# EAGLE design subliminal1 (EAGLE 9.0.1)
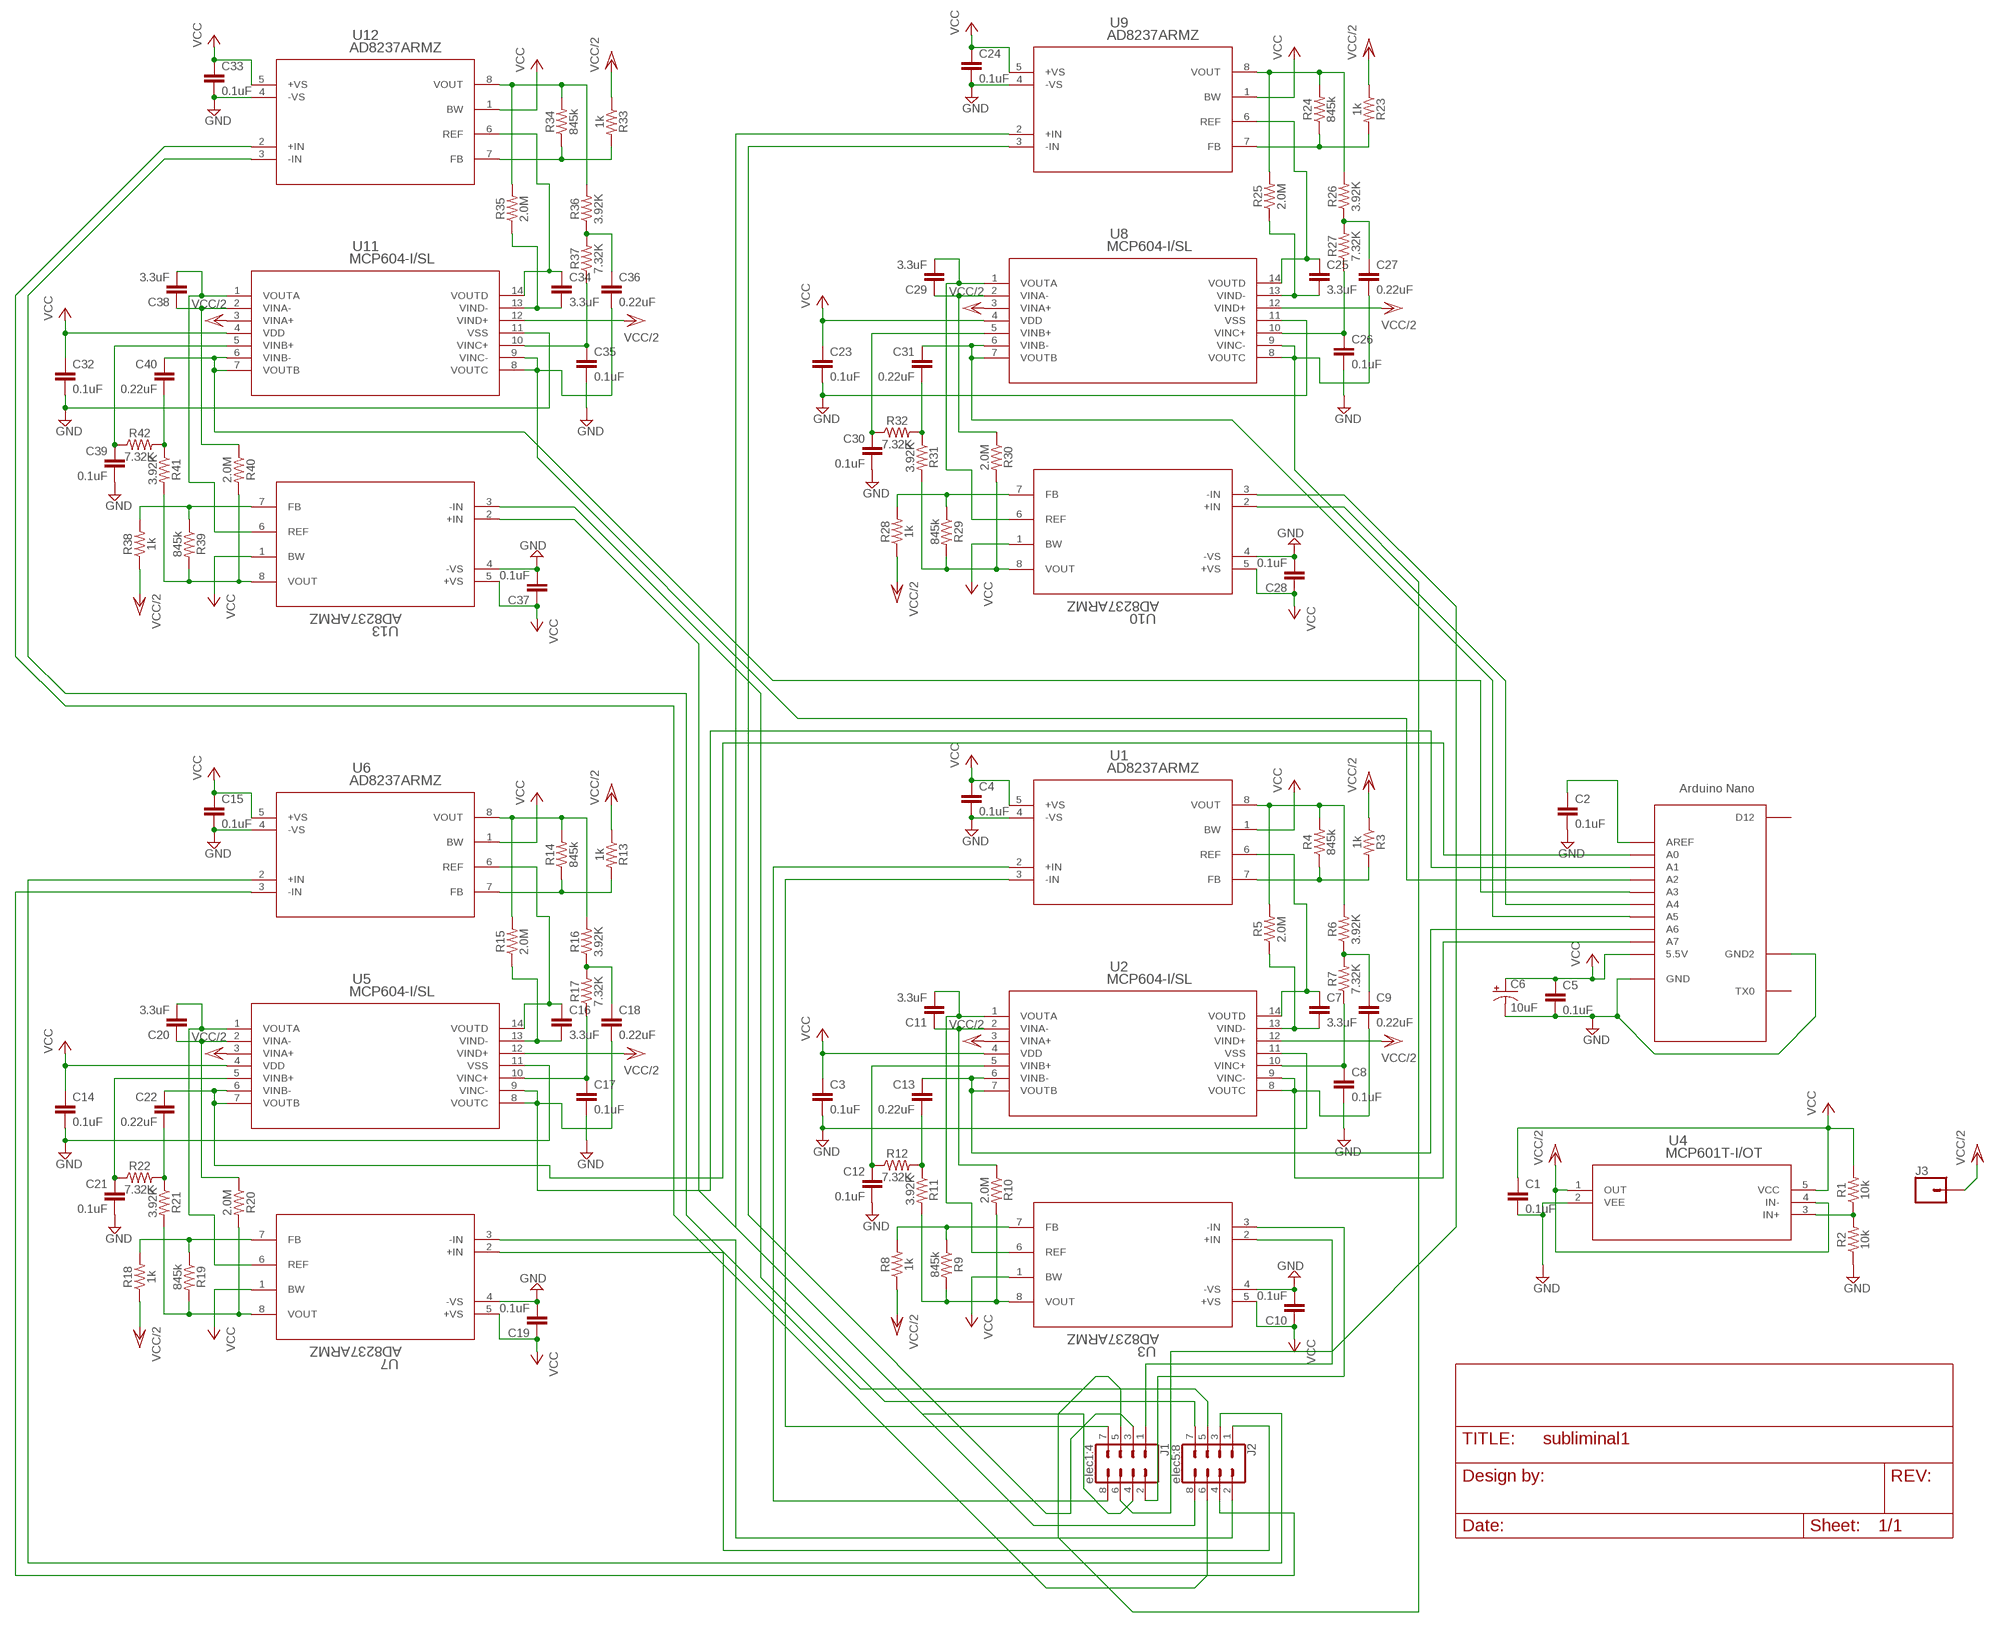
[diagram p0: schematic, sheet 1, part 1 of 2]
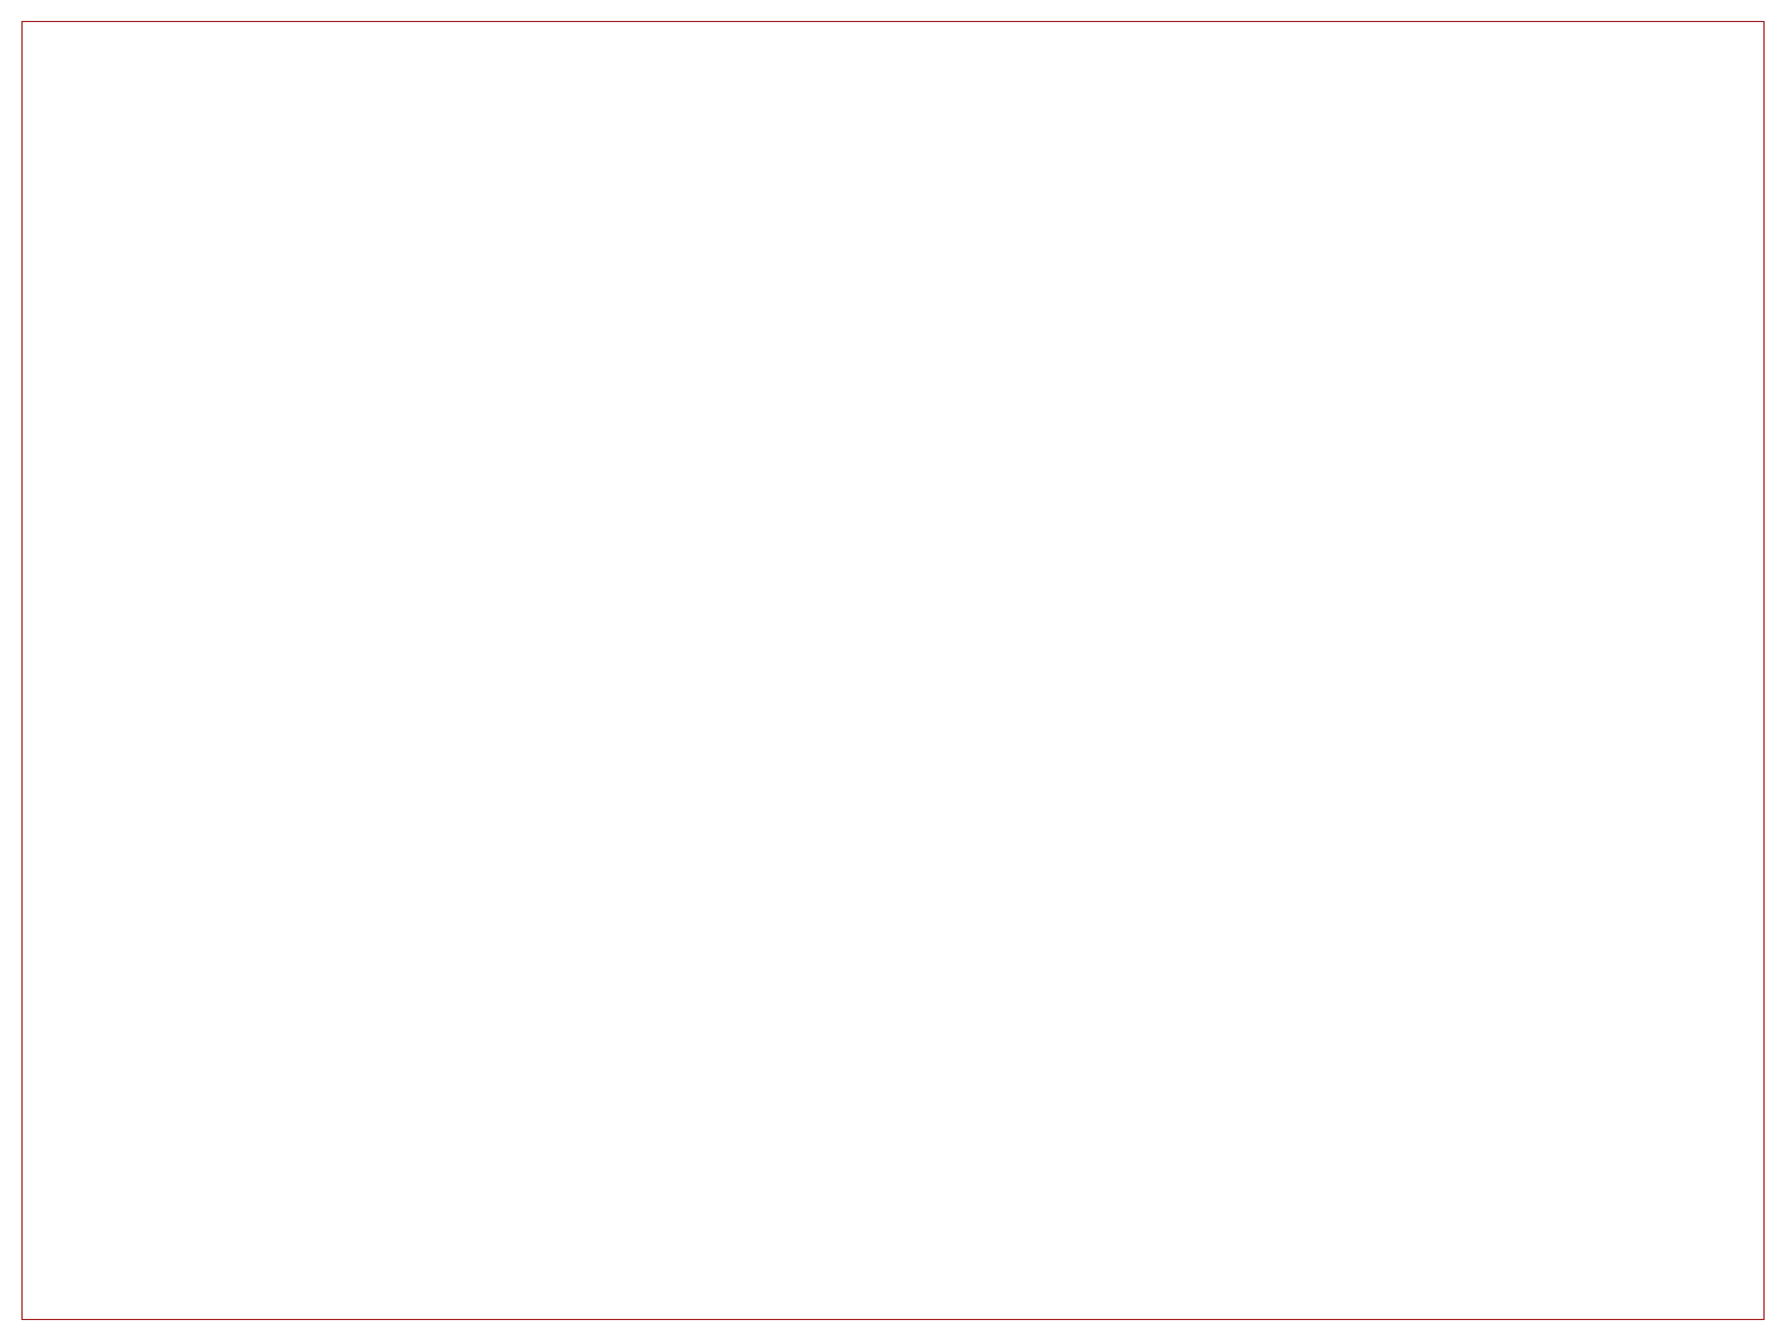
[diagram p1: schematic, sheet 1, part 2 of 2]

## Parts
C1  0.1uF  0.1UF-0603-25V-(+80/-20%)  [0603]
C2  0.1uF  0.1UF-0603-25V-(+80/-20%)  [0603]
C3  0.1uF  0.1UF-0603-25V-(+80/-20%)  [0603]
C4  0.1uF  0.1UF-0603-25V-(+80/-20%)  [0603]
C5  0.1uF  0.1UF-0603-25V-(+80/-20%)  [0603]
C6  10uF  10UF-POLAR-EIA3216-16V-10%(TANT)  [EIA3216]
C7  3.3uF  3.3UF-0603-10V-10%  [0603]
C8  0.1uF  0.1UF-0603-25V-(+80/-20%)  [0603]
C9  0.22uF  0.22UF-0603-25V-10%  [0603]
C10  0.1uF  0.1UF-0603-25V-(+80/-20%)  [0603]
C11  3.3uF  3.3UF-0603-10V-10%  [0603]
C12  0.1uF  0.1UF-0603-25V-(+80/-20%)  [0603]
C13  0.22uF  0.22UF-0603-25V-10%  [0603]
C14  0.1uF  0.1UF-0603-25V-(+80/-20%)  [0603]
C15  0.1uF  0.1UF-0603-25V-(+80/-20%)  [0603]
C16  3.3uF  3.3UF-0603-10V-10%  [0603]
C17  0.1uF  0.1UF-0603-25V-(+80/-20%)  [0603]
C18  0.22uF  0.22UF-0603-25V-10%  [0603]
C19  0.1uF  0.1UF-0603-25V-(+80/-20%)  [0603]
C20  3.3uF  3.3UF-0603-10V-10%  [0603]
C21  0.1uF  0.1UF-0603-25V-(+80/-20%)  [0603]
C22  0.22uF  0.22UF-0603-25V-10%  [0603]
C23  0.1uF  0.1UF-0603-25V-(+80/-20%)  [0603]
C24  0.1uF  0.1UF-0603-25V-(+80/-20%)  [0603]
C25  3.3uF  3.3UF-0603-10V-10%  [0603]
C26  0.1uF  0.1UF-0603-25V-(+80/-20%)  [0603]
C27  0.22uF  0.22UF-0603-25V-10%  [0603]
C28  0.1uF  0.1UF-0603-25V-(+80/-20%)  [0603]
C29  3.3uF  3.3UF-0603-10V-10%  [0603]
C30  0.1uF  0.1UF-0603-25V-(+80/-20%)  [0603]
C31  0.22uF  0.22UF-0603-25V-10%  [0603]
C32  0.1uF  0.1UF-0603-25V-(+80/-20%)  [0603]
C33  0.1uF  0.1UF-0603-25V-(+80/-20%)  [0603]
C34  3.3uF  3.3UF-0603-10V-10%  [0603]
C35  0.1uF  0.1UF-0603-25V-(+80/-20%)  [0603]
C36  0.22uF  0.22UF-0603-25V-10%  [0603]
C37  0.1uF  0.1UF-0603-25V-(+80/-20%)  [0603]
C38  3.3uF  3.3UF-0603-10V-10%  [0603]
C39  0.1uF  0.1UF-0603-25V-(+80/-20%)  [0603]
C40  0.22uF  0.22UF-0603-25V-10%  [0603]
J1  elec1:4  CONN_04X2  [2X4]
J2  elec5:8  CONN_04X2  [2X4]
J3  CONN_01  [1X01]
R1  10k  10KOHM-0603-1/10W-1%  [0603]
R2  10k  10KOHM-0603-1/10W-1%  [0603]
R3  1k  1KOHM-0603-1/10W-1%  [0603]
R4  845k  845KOHM-0603-1/10W-1%  [0603]
R5  2.0M  2MOHMS-0603-1/10W-1%  [0603]
R6  3.92K  3.92KOHM-0603-1/10W-1%  [0603]
R7  7.32K  7.32KOHM-0603-1/10W-1%  [0603]
R8  1k  1KOHM-0603-1/10W-1%  [0603]
R9  845k  845KOHM-0603-1/10W-1%  [0603]
R10  2.0M  2MOHMS-0603-1/10W-1%  [0603]
R11  3.92K  3.92KOHM-0603-1/10W-1%  [0603]
R12  7.32K  7.32KOHM-0603-1/10W-1%  [0603]
R13  1k  1KOHM-0603-1/10W-1%  [0603]
R14  845k  845KOHM-0603-1/10W-1%  [0603]
R15  2.0M  2MOHMS-0603-1/10W-1%  [0603]
R16  3.92K  3.92KOHM-0603-1/10W-1%  [0603]
R17  7.32K  7.32KOHM-0603-1/10W-1%  [0603]
R18  1k  1KOHM-0603-1/10W-1%  [0603]
R19  845k  845KOHM-0603-1/10W-1%  [0603]
R20  2.0M  2MOHMS-0603-1/10W-1%  [0603]
R21  3.92K  3.92KOHM-0603-1/10W-1%  [0603]
R22  7.32K  7.32KOHM-0603-1/10W-1%  [0603]
R23  1k  1KOHM-0603-1/10W-1%  [0603]
R24  845k  845KOHM-0603-1/10W-1%  [0603]
R25  2.0M  2MOHMS-0603-1/10W-1%  [0603]
R26  3.92K  3.92KOHM-0603-1/10W-1%  [0603]
R27  7.32K  7.32KOHM-0603-1/10W-1%  [0603]
R28  1k  1KOHM-0603-1/10W-1%  [0603]
R29  845k  845KOHM-0603-1/10W-1%  [0603]
R30  2.0M  2MOHMS-0603-1/10W-1%  [0603]
R31  3.92K  3.92KOHM-0603-1/10W-1%  [0603]
R32  7.32K  7.32KOHM-0603-1/10W-1%  [0603]
R33  1k  1KOHM-0603-1/10W-1%  [0603]
R34  845k  845KOHM-0603-1/10W-1%  [0603]
R35  2.0M  2MOHMS-0603-1/10W-1%  [0603]
R36  3.92K  3.92KOHM-0603-1/10W-1%  [0603]
R37  7.32K  7.32KOHM-0603-1/10W-1%  [0603]
R38  1k  1KOHM-0603-1/10W-1%  [0603]
R39  845k  845KOHM-0603-1/10W-1%  [0603]
R40  2.0M  2MOHMS-0603-1/10W-1%  [0603]
R41  3.92K  3.92KOHM-0603-1/10W-1%  [0603]
R42  7.32K  7.32KOHM-0603-1/10W-1%  [0603]
U1  AD8237ARMZ  [RM_8]
U2  MCP604-I/SL  [SOIC14-N_MC]
U3  AD8237ARMZ  [RM_8]
U4  MCP601T-I/OT  [SOT-23-5_MC]
U5  MCP604-I/SL  [SOIC14-N_MC]
U6  AD8237ARMZ  [RM_8]
U7  AD8237ARMZ  [RM_8]
U8  MCP604-I/SL  [SOIC14-N_MC]
U9  AD8237ARMZ  [RM_8]
U10  AD8237ARMZ  [RM_8]
U11  MCP604-I/SL  [SOIC14-N_MC]
U12  AD8237ARMZ  [RM_8]
U13  AD8237ARMZ  [RM_8]
U$1  ANALOG-NANO  [ANANANOMIN]

## Nets
GND: C1.2 C2.2 C3.2 C4.2 C5.2 C6.- C8.2 C10.2 C12.2 C14.2 C15.2 C17.2 C19.2 C21.2 C23.2 C24.2 C26.2 C28.2 C30.2 C32.2 C33.2 C35.2 C37.2 C39.2 R2.1 U1.4(-VS) U2.11(VSS) U3.4(-VS) U4.2(VEE) U5.11(VSS) U6.4(-VS) U7.4(-VS) U8.11(VSS) U9.4(-VS) U10.4(-VS) U11.11(VSS) U12.4(-VS) U13.4(-VS) U$1.GND U$1.GND1(GND2)
N$1: C2.1 U$1.AREF
N$2: R1.1 R2.2 U4.3(IN+)
N$3: R8.2 R9.1 U3.7(FB)
N$4: R9.2 R10.2 R11.2 U3.8(VOUT)
N$5: R4.2 R5.2 R6.2 U1.8(VOUT)
N$6: R3.2 R4.1 U1.7(FB)
N$7: C9.1 R6.1 R7.2
N$8: C7.2 R5.1 U2.13(VIND-)
N$9: C7.1 U1.6(REF) U2.14(VOUTD)
N$10: C8.1 R7.1 U2.10(VINC+)
N$11: R13.2 R14.1 U6.7(FB)
N$12: C13.1 U2.6(VINB-) U2.7(VOUTB) U$1.A6
N$13: C11.2 U2.1(VOUTA) U3.6(REF)
N$14: C13.2 R11.1 R12.2
N$15: R14.2 R15.2 R16.2 U6.8(VOUT)
N$16: C16.2 R15.1 U5.13(VIND-)
N$17: C16.1 U5.14(VOUTD) U6.6(REF)
N$18: C18.1 R16.1 R17.2
N$19: C17.1 R17.1 U5.10(VINC+)
N$20: R18.2 R19.1 U7.7(FB)
N$21: C12.1 R12.1 U2.5(VINB+)
N$22: C9.2 U2.8(VOUTC) U2.9(VINC-) U$1.A7
N$23: R19.2 R20.2 R21.2 U7.8(VOUT)
N$24: C11.1 R10.1 U2.2(VINA-)
N$25: C20.2 U5.1(VOUTA) U7.6(REF)
N$26: C18.2 U5.8(VOUTC) U5.9(VINC-) U$1.A1
N$27: C20.1 R20.1 U5.2(VINA-)
N$28: C22.1 U5.6(VINB-) U5.7(VOUTB) U$1.A0
N$29: C22.2 R21.1 R22.2
N$30: C21.1 R22.1 U5.5(VINB+)
N$31: R23.2 R24.1 U9.7(FB)
N$32: R24.2 R25.2 R26.2 U9.8(VOUT)
N$33: C25.2 R25.1 U8.13(VIND-)
N$34: C25.1 U8.14(VOUTD) U9.6(REF)
N$35: C27.1 R26.1 R27.2
N$36: C26.1 R27.1 U8.10(VINC+)
N$37: R28.2 R29.1 U10.7(FB)
N$38: R29.2 R30.2 R31.2 U10.8(VOUT)
N$39: C29.2 U8.1(VOUTA) U10.6(REF)
N$40: C27.2 U8.8(VOUTC) U8.9(VINC-) U$1.A4
N$41: C29.1 R30.1 U8.2(VINA-)
N$42: C31.1 U8.6(VINB-) U8.7(VOUTB) U$1.A5
N$43: C31.2 R31.1 R32.2
N$44: C30.1 R32.1 U8.5(VINB+)
N$45: R33.2 R34.1 U12.7(FB)
N$46: R34.2 R35.2 R36.2 U12.8(VOUT)
N$47: C34.2 R35.1 U11.13(VIND-)
N$48: C34.1 U11.14(VOUTD) U12.6(REF)
N$49: C36.1 R36.1 R37.2
N$50: C35.1 R37.1 U11.10(VINC+)
N$51: R38.2 R39.1 U13.7(FB)
N$52: R39.2 R40.2 R41.2 U13.8(VOUT)
N$53: C38.2 U11.1(VOUTA) U13.6(REF)
N$54: C36.2 U11.8(VOUTC) U11.9(VINC-) U$1.A2
N$55: C38.1 R40.1 U11.2(VINA-)
N$57: C40.2 R41.1 R42.2
N$58: C39.1 R42.1 U11.5(VINB+)
N$59: J1.7 U1.3(-IN)
N$60: J1.8 U1.2(+IN)
N$61: J1.1 U3.2(+IN)
N$62: J1.4 U9.2(+IN)
N$63: J2.2 U7.3(-IN)
N$64: J2.1 U7.2(+IN)
N$65: J2.3 U6.2(+IN)
N$66: J2.4 U6.3(-IN)
N$67: J1.2 U3.3(-IN)
N$68: J1.3 U9.3(-IN)
N$69: J2.8 U13.2(+IN)
N$70: J2.7 U13.3(-IN)
N$71: J2.5 U12.3(-IN)
N$72: J2.6 U12.2(+IN)
N$73: J1.5 U10.2(+IN)
N$74: J1.6 U10.3(-IN)
N$75: C40.1 U11.6(VINB-) U11.7(VOUTB) U$1.A3
VCC: C1.1 C3.1 C4.1 C5.1 C6.+ C10.1 C14.1 C15.1 C19.1 C23.1 C24.1 C28.1 C32.1 C33.1 C37.1 R1.2 U1.1(BW) U1.5(+VS) U2.4(VDD) U3.1(BW) U3.5(+VS) U4.5(VCC) U5.4(VDD) U6.1(BW) U6.5(+VS) U7.1(BW) U7.5(+VS) U8.4(VDD) U9.1(BW) U9.5(+VS) U10.1(BW) U10.5(+VS) U11.4(VDD) U12.1(BW) U12.5(+VS) U13.1(BW) U13.5(+VS) U$1.5V(5.5V)
VCC/2: J3.1 R3.1 R8.1 R13.1 R18.1 R23.1 R28.1 R33.1 R38.1 U2.3(VINA+) U2.12(VIND+) U4.1(OUT) U4.4(IN-) U5.3(VINA+) U5.12(VIND+) U8.3(VINA+) U8.12(VIND+) U11.3(VINA+) U11.12(VIND+)
Unconnected: U$1.D12 U$1.TX0

## Library data of the parts
C1-C5 C8 C10 C12 C14 C15 C17 C19 C21 C23 C24 C26 C28 C30 C32 C33 C35 C37 C39 = SparkFun-Capacitors:0.1UF: 0.1µF ceramic capacitors A capacitor is a passive two-terminal electrical component used to store electrical energy temporarily in an electric field.; PROD_ID: CAP-00810
C6 = SparkFun-Capacitors:10UF-POLAR: 10.0µF polarized capacitors A capacitor is a passive two-terminal electrical component used to store electrical energy temporarily in an electric field.; PROD_ID: CAP-00811
C7 C11 C16 C20 C25 C29 C34 C38 = myLibrary:3.3UF: 3.3µF ceramic capacitors A capacitor is a passive two-terminal electrical component used to store electrical energy temporarily in an electric field.
C9 C13 C18 C22 C27 C31 C36 C40 = SparkFun-Capacitors:0.22UF: 0.22µF ceramic capacitors A capacitor is a passive two-terminal electrical component used to store electrical energy temporarily in an electric field.; PROD_ID: CAP-07822
J1 J2 = SparkFun-Connectors:CONN_04X2: Multi connection point. Often used as Generic Header-pin footprint for 0.1 inch spaced/style header connections On any of the 0.1 inch spaced packages, you can populate with these: Break Away Headers - Straight <https://www.sparkfun.com/products/116> (PRT-00116) Break Away Male Headers - Right Angle <https://www.sparkfun.com/products/553> (PRT-00553) Female Headers <https://www.sparkfun.com/products/115> (PRT-00115) Break Away Headers - Machine Pin <https://www.sparkfun.com/products/117> (PRT-00117) Break Away Female Headers - Swiss Machine Pin <https://www.sparkfun.com/products/743> (PRT-00743)
J3 = SparkFun-Connectors:CONN_01: Single connection point. Often used as Generic Header-pin footprint for 0.1 inch spaced/style header connections On any of the 0.1 inch spaced packages, you can populate with these: Break Away Headers - Straight <https://www.sparkfun.com/products/116> (PRT-00116) Break Away Male Headers - Right Angle <https://www.sparkfun.com/products/553> (PRT-00553) Female Headers <https://www.sparkfun.com/products/115> (PRT-00115) Break Away Headers - Machine Pin <https://www.sparkfun.com/products/117> (PRT-00117) Break Away Female Headers - Swiss Machine Pin <https://www.sparkfun.com/products/743> (PRT-00743) This device is also useful as a general connection point to wire up your design to another part of your project. Our various solder wires solder well into these plated through hole pads. Hook-Up Wire - Assortment (Stranded, 22 AWG) <https://www.sparkfun.com/products/11375> (PRT-11375) Hook-Up Wire - Assortment (Solid Core, 22 AWG) <https://www.sparkfun.com/products/11367> (PRT-11367) View the entire wire category on our website here <https://www.sparkfun.com/categories/141> Special notes: SMTSO-256-ET is a "flush mount" nut for a 4-40 screw. We mostly use this on specialty testbeds; it is a nice way to connect hardware to your PCB at an adjustable hieght. Also note, the SNAP packages are for using a snappable style connector. We sell a baggie of snaps and they are also used on two LilyPad designs: Snap Assortment - 30 pack (male and female) <https://www.sparkfun.com/products/11347> (DEV-11347) LilyPad Arduino SimpleSnap <https://www.sparkfun.com/products/10941> (DEV-10941) LilyPad SimpleSnap Protoboard <https://www.sparkfun.com/products/10940> (DEV-10940)
R1 R2 = SparkFun-Resistors:10KOHM: 10kΩ resistor A resistor is a passive two-terminal electrical component that implements electrical resistance as a circuit element. Resistors act to reduce current flow, and, at the same time, act to lower voltage levels within circuits. - Wikipedia; PROD_ID: RES-00824
R3 R8 R13 R18 R23 R28 R33 R38 = SparkFun-Resistors:1KOHM: 1kΩ resistor A resistor is a passive two-terminal electrical component that implements electrical resistance as a circuit element. Resistors act to reduce current flow, and, at the same time, act to lower voltage levels within circuits. - Wikipedia; PROD_ID: RES-07856
R4 R9 R14 R19 R24 R29 R34 R39 = myLibrary:845KOHM: 845kΩ resistor A resistor is a passive two-terminal electrical component that implements electrical resistance as a circuit element. Resistors act to reduce current flow, and, at the same time, act to lower voltage levels within circuits. - Wikipedia
R5 R10 R15 R20 R25 R30 R35 R40 = SparkFun-Resistors:2MOHMS: 2MΩ resistor A resistor is a passive two-terminal electrical component that implements electrical resistance as a circuit element. Resistors act to reduce current flow, and, at the same time, act to lower voltage levels within circuits. - Wikipedia; PROD_ID: RES-10054
R6 R11 R16 R21 R26 R31 R36 R41 = myLibrary:3.92KOHM
R7 R12 R17 R22 R27 R32 R37 R42 = myLibrary:7.32KOHM
U1 U3 U6 U7 U9 U10 U12 U13 = ad8237:AD8237ARMZ; MANUFACTURER_PART_NUMBER: AD8237ARMZ; VENDOR: Analog Devices Inc
U2 U5 U8 U11 = mcp604:MCP604-I/SL; MANUFACTURER_PART_NUMBER: MCP604ISL; VENDOR: Microchip
U4 = mcp601:MCP601T-I/OT; MANUFACTURER_PART_NUMBER: MCP601TIOT; VENDOR: Microchip
U$1 = Arduino-clone:ANALOG-NANO: Arduino Nano

## Board
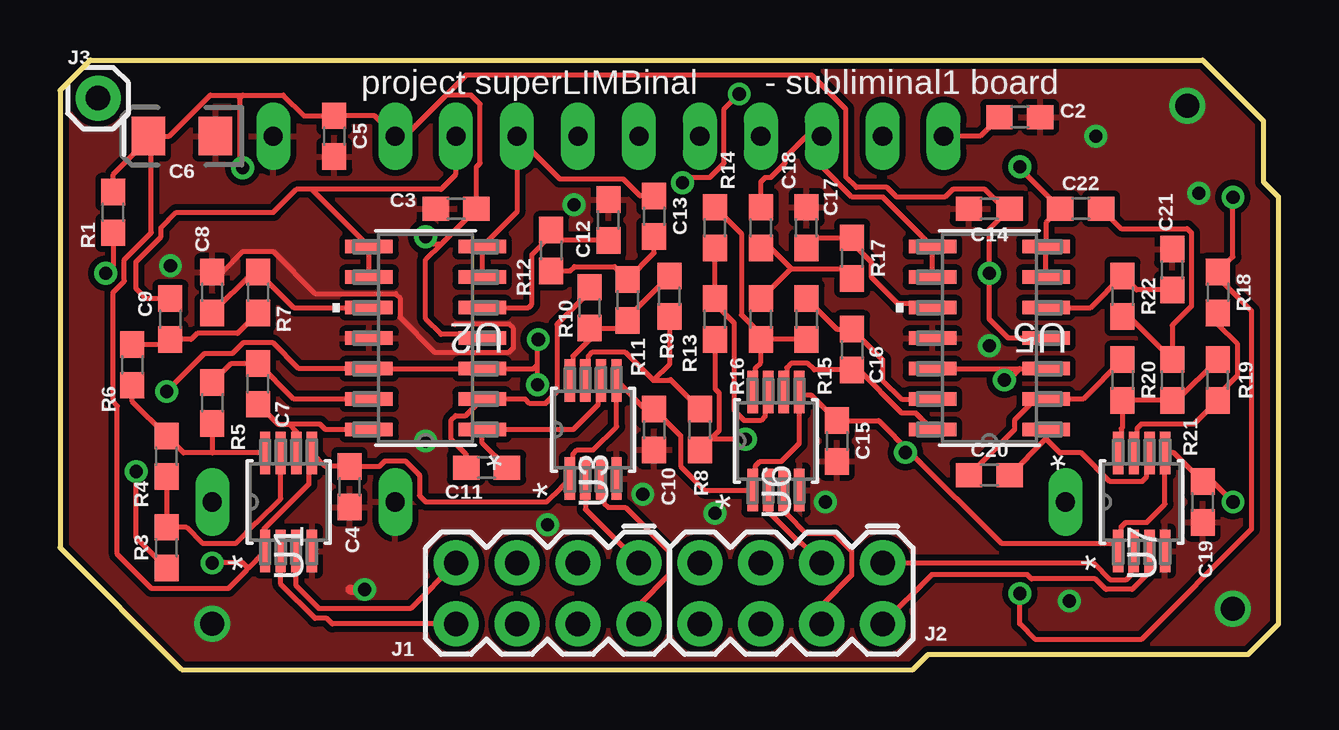
[diagram p2: board, top side]
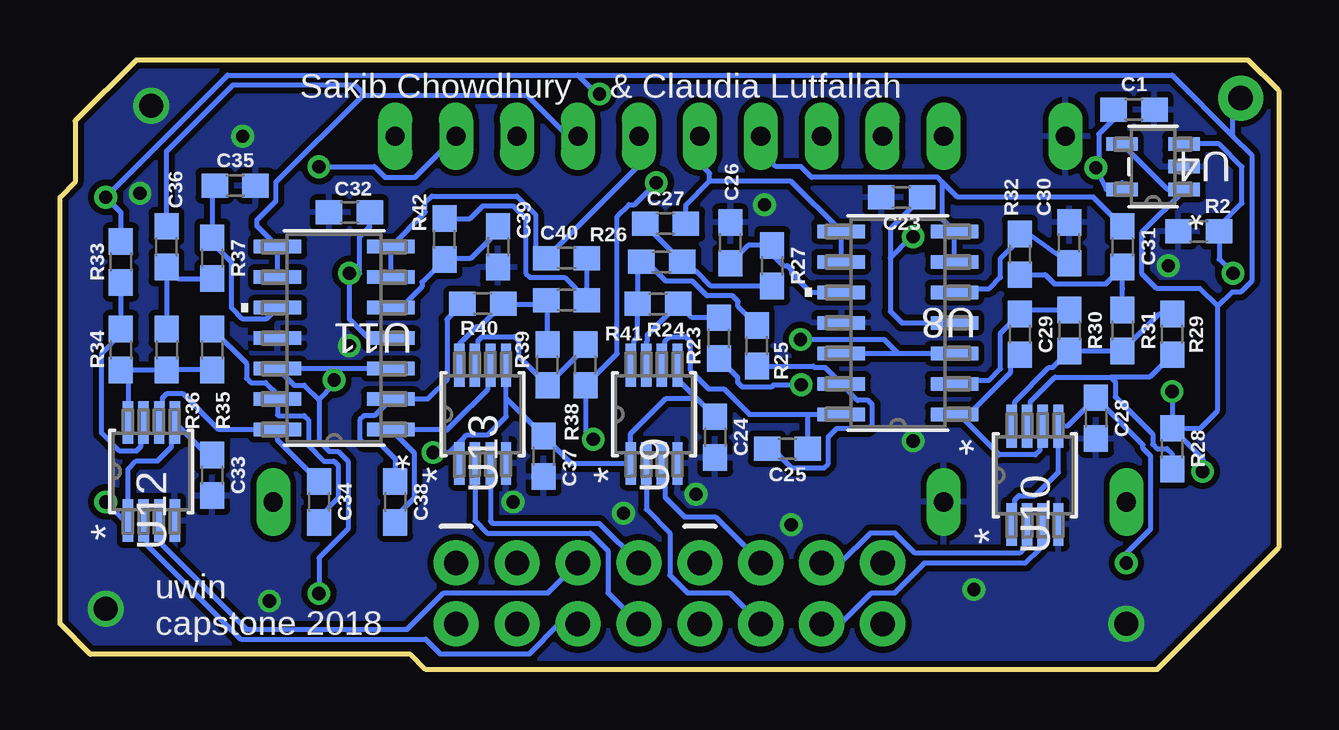
[diagram p3: board, bottom side, seen from below]

Size 50.8 x 25.4 mm. Coordinates in mm from the lower left corner, seen from the top.
Outline: 1.27,25.4 47.62,25.4 50.16,22.86 50.16,20.32 50.8,19.68 50.8,1.91 49.53,0.64 36.2,0.64 35.56,0 5.08,0 0,5.08 0,24.13 1.27,25.4
Copper layers (1*16): Top 0.035mm / dielectric 1.5mm / Bottom 0.035mm
Design rules "SparkFun *": minimum track width 8mil, minimum drill 0.3mm, track to track 8mil, track to pad 8mil, pad to pad 8mil, via to via 8mil, smd to smd 8mil, copper to edge 10mil, drill to drill 8mil, minimum pad ring 12mil, minimum via ring 0.2mm, stop-mask expansion 4mil, vias tented up to drill 25mil, thermal gap 10mil

### Footprints (pad centres in the part's own frame; a part is rotated, then mirrored left to right if it is on the bottom)
0603 = smd 1.1 x 1: 1 -0.85,0; 2 0.85,0
EIA3216 = smd 1.4 x 1.6: + 1.4,0; - -1.4,0
2X4 = drill 1.016 pad 1.88: 1 -3.81,-1.27; 2 -3.81,1.27; 3 -1.27,-1.27; 4 -1.27,1.27; 5 1.27,-1.27; 6 1.27,1.27; 7 3.81,-1.27; 8 3.81,1.27
1X01 = drill 1.016 pad 1.88: 1 0,0
RM_8 = smd 1.778 x 0.432: 1 -2.045,0.975; 2 -2.045,0.325; 3 -2.045,-0.325; 4 -2.045,-0.975; 5 2.045,-0.975; 6 2.045,-0.325; 7 2.045,0.325; 8 2.045,0.975
SOIC14-N_MC = smd 1.981 x 0.559: 1 -2.362,3.81; 2 -2.362,2.54; 3 -2.362,1.27; 4 -2.362,0; 5 -2.362,-1.27; 6 -2.362,-2.54; 7 -2.362,-3.81; 8 2.362,-3.81; 9 2.362,-2.54; 10 2.362,-1.27; 11 2.362,0; 12 2.362,1.27; 13 2.362,2.54; 14 2.362,3.81
SOT-23-5_MC = smd 1.321 x 0.559: 1 -1.295,0.95; 2 -1.295,0; 3 -1.295,-0.95; 4 1.295,-0.95; 5 1.295,0.95
ANANANOMIN = drill 0.8 long: 5V -10.16,-1.27; A0 -10.16,19.05; A1 -10.16,16.51; A2 -10.16,13.97; A3 -10.16,11.43; A4 -10.16,8.89; A5 -10.16,6.35; A6 -10.16,3.81; A7 -10.16,1.27; AREF -10.16,21.59; D12 5.08,26.67; GND -10.16,-6.35; GND1 5.08,-1.27; TX0 5.08,-8.89

### Placement (x,y rotation side)
C1  6.03,23.34 0 bottom
C2  40.01,23.02 0 top
C3  16.51,19.21 180 top
C4  12.06,7.62 270 top
C5  11.43,22.23 270 top
C6  5.08,22.23 180 top
C7  8.26,11.91 90 top
C8  6.35,15.72 90 top
C9  4.6,14.61 90 top
C10  24.77,10 270 top
C11  17.78,8.41 0 top
C12  22.86,18.73 90 top
C13  24.77,18.89 270 top
C14  38.73,19.21 180 top
C15  32.38,9.53 270 top
C16  33.02,13.34 90 top
C17  31.11,18.41 90 top
C18  29.21,18.41 90 top
C19  47.62,6.99 270 top
C20  38.73,8.1 0 top
C21  46.35,16.67 90 top
C22  42.55,19.21 0 top
C23  15.72,19.68 180 bottom
C24  23.5,9.68 270 bottom
C25  20.48,9.21 180 bottom
C26  22.86,17.78 90 bottom
C27  25.56,18.57 0 bottom
C28  7.62,10.48 270 bottom
C29  10.79,13.97 270 bottom
C30  8.73,17.78 90 bottom
C31  6.51,17.62 270 bottom
C32  38.73,19.05 180 bottom
C33  44.45,8.1 270 bottom
C34  40.01,6.99 270 bottom
C35  43.5,20.16 0 bottom
C36  46.35,17.62 90 bottom
C37  30.64,8.89 270 bottom
C38  36.83,6.99 270 bottom
C39  32.54,17.62 270 bottom
C40  29.69,17.14 0 bottom
J1  20.32,3.17 180 top
J2  30.48,3.17 180 top
J3  1.59,23.81 0 top
R1  2.22,19.05 90 top
R2  3.33,18.26 0 bottom
R3  4.45,5.08 90 top
R4  4.45,8.89 90 top
R5  6.35,11.11 270 top
R6  3.02,12.7 270 top
R7  8.26,15.72 270 top
R8  26.67,10 90 top
R9  25.4,15.56 90 top
R10  22.07,15.08 270 top
R11  23.65,15.4 270 top
R12  20.48,17.46 270 top
R13  27.3,14.61 90 top
R14  27.3,18.41 90 top
R15  31.11,14.61 270 top
R16  29.21,14.61 270 top
R17  33.02,17.14 270 top
R18  48.26,15.72 270 top
R19  48.26,12.06 90 top
R20  44.29,12.06 270 top
R21  46.35,12.06 270 top
R22  44.29,15.56 270 top
R23  23.34,13.81 90 bottom
R24  25.88,15.24 180 bottom
R25  21.75,13.49 90 bottom
R26  25.72,16.99 180 bottom
R27  21.11,16.83 270 bottom
R28  4.45,9.21 270 bottom
R29  4.45,13.97 90 bottom
R30  8.73,14.13 270 bottom
R31  6.51,14.13 270 bottom
R32  10.79,17.3 270 bottom
R33  48.26,16.99 270 bottom
R34  48.26,13.34 270 bottom
R35  44.45,13.34 270 bottom
R36  46.35,13.34 270 bottom
R37  44.45,17.14 270 bottom
R38  28.89,12.7 90 bottom
R39  30.48,12.7 90 bottom
R40  33.18,15.24 0 bottom
R41  29.69,15.4 180 bottom
R42  34.77,17.94 90 bottom
U1  9.53,6.99 90 top
U2  15.24,13.81 180 top
U3  22.23,10 90 top
U4  5.24,20.95 180 bottom
U5  38.73,13.81 180 top
U6  29.84,9.53 90 top
U7  45.09,6.99 90 top
U8  15.88,14.45 180 bottom
U9  26.04,10.64 90 bottom
U10  10.16,8.1 90 bottom
U11  39.37,13.81 180 bottom
U12  46.99,8.26 90 bottom
U13  33.18,10.64 90 bottom
U$1  15.24,12.06 270 top

### Tracks (layer width: path | path; a pad name or v marks a point on that pad's centre or on a via)
GND  (via drill 0.55 pad 0.65, 1)
  Top 0.203: 16.47,14.38 16.48,14.39 18.72,14.39 18.9,14.22 18.9,13.41 18.72,13.23 15.62,13.23 14.17,14.68 14.17,15.49 13.99,15.66 10.64,15.66 8.88,17.42 7.63,17.42 6.77,16.57 C8.2
  Top 0.406: 12.11,3.33 v12.7,3.33
  other vias: 27.3,6.51 31.91,6.99 20.32,6.03 24.29,7.3 38.73,13.49 4.6,16.83 21.43,19.37 43.18,22.23 47.47,19.84 42.07,2.86 15.24,9.53 6.35,1.91 48.9,2.54 46.99,23.5
  pour Top (isolate 0.254): 0,24.13 0,5.08 5.08,0 35.56,0 36.2,0.64 49.53,0.64 50.8,1.91 50.8,19.68 50.16,20.32 50.16,22.86 47.62,25.4 1.27,25.4
  pour Bottom (isolate 0.254): 1.27,25.4 47.62,25.4 50.16,22.86 50.16,20.32 50.8,19.68 50.8,1.91 49.53,0.64 36.2,0.64 35.56,0 5.08,0 0,5.08 0,24.13
N$1
  Top 0.203: C2.1 38.36,22.23 U$1.AREF
N$2  (via drill 0.55 pad 0.65)
  Top 0.203: R1.1 2.22,16.83 v1.91,16.51
  Bottom 0.203: v1.91,16.51 2.48,17.09 R2.2 2.48,18.47 1.53,19.42 1.53,20.95 2.48,21.91 U4.3
N$3
  Top 0.203: R8.2 25.43,12.09 25.38,12.05 24.74,12.05 | U3.7 22.03,12.18 22.03,13.06 22.21,13.24 23.54,13.24 24.74,12.05 | R9.1 25.4,12.71 24.74,12.05
N$4
  Top 0.203: 21.75,14.39 R10.2 | U3.8 21.38,12.18 21.38,13.06 22.07,13.75 R10.2 | R10.2 23.34,14.23 R11.2 23.65,14.66 R9.2
N$5
  Top 0.203: U1.8 6.35,9.03 | 6.35,9.03 5.16,9.03 R4.2 3.02,11.17 R6.2 | R5.2 6.35,9.03
N$6
  Top 0.203: R4.1 R3.2 5.27,5.93 5.93,5.27 7.34,5.27 8.21,6.13 | 8.21,6.13 | 8.21,6.13 9.2,7.13 U1.7
N$7
  Top 0.203: R7.2 7.4,14.01 5.72,14.01 5.47,13.76 C9.1 4.4,13.55 R6.1
N$8
  Top 0.203: U2.13 9.74,11.27 C7.2 7.14,12.76 R5.1
N$9
  Top 0.203: C7.1 9.09,10.22 9.53,10.22 9.54,10.22 | 9.54,10.22 9.85,9.92 U1.6 | U2.14 11.06,10 10.84,10.22 9.54,10.22
N$10
  Top 0.203: C8.1 8.05,16.57 R7.1 9.74,15.08 U2.10
N$11
  Top 0.203: R14.1 R13.2 27.3,15.24 28.11,14.43 28.11,10.79 28.53,10.38 29.21,10.38 29.39,10.55 29.39,11.44 U6.7
N$12
  Top 0.203: U2.6 U2.7 19.05,19.07 U$1.A6 20.84,20.44 23.49,20.44 24.18,19.74 C13.1
N$13
  Top 0.203: C11.2 17.6,9.44 U2.1 21.39,10 22.42,11.03 22.42,11.92 U3.6
N$14
  Top 0.203: C13.2 24.77,17.36 R11.1 23.12,16.79 21.44,16.79 21.27,16.61 R12.2
N$15
  Top 0.203: R14.2 28.41,18.16 28.41,14.78 29.21,13.97 R16.2 29.21,13.34 | U6.8 29,11.7 29,12.59 29.21,12.8 29.21,13.34 | R15.2 29.63,13.76 29.21,13.34
N$16
  Top 0.203: R15.1 32.38,14.19 C16.2 34.29,12.91 34.29,12.06 35.08,11.27 U5.13
N$17
  Top 0.203: U5.14 35.69,10.69 35.09,10.69 33.3,12.48 C16.1 31.44,12.48 31.16,12.76 30.48,12.76 30.3,12.59 30.3,11.7 U6.6
N$18
  Top 0.203: C18.1 29.63,17.57 30.49,16.71 | R17.2 32.6,16.71 30.49,16.71 | R16.1 30.46,16.71 30.49,16.71
N$19
  Top 0.203: C17.1 31.55,18 R17.1 33.02,17.78 33.83,16.97 33.83,16.34 34.92,15.24 36.21,15.24 U5.10
N$20
  Top 0.203: U7.7 44.89,9.16 44.89,10.04 45.07,10.22 47.27,10.22 R19.1 48.26,11.43 49.06,12.24 49.06,13.59 48.26,14.4 R18.2
N$21
  Top 0.203: U2.5 19.53,15.08 19.67,15.23 19.67,17.29 20.48,18.09 R12.1 20.91,17.88 C12.1
N$22
  Top 0.203: U2.9 U2.8 10.49,20.01 | U$1.A7 16.51,20.65 15.88,20.01 10.49,20.01 | 10.49,20.01 9.85,20.01 8.89,19.05 4.85,19.05 4.22,18.41 4.22,18.04 3.17,17 3.17,15.88 3.6,15.46 C9.2
N$23
  Top 0.203: U7.8 44.24,9.16 44.24,10.04 44.29,10.1 R20.2 R21.2 46.56,11.21 R19.2
N$24
  Top 0.203: C11.1 16.93,8.97 16.31,9.6 16.31,10.41 16.48,10.59 16.92,10.59 U2.2 19.4,11.27 19.58,11.08 20.23,11.08 20.71,11.57 20.71,14.38 22.07,15.73 R10.1
N$25
  Top 0.203: C20.2 41.1,9.61 | 41.1,9.61 U5.1 | 41.1,9.61 41.68,9.03 42.57,9.03 43.77,7.84 45.1,7.84 45.28,8.01 45.28,8.9 U7.6
N$26
  Top 0.203: C18.2 29.21,20.32 29.4,20.51 29.63,20.51 30.22,21.1 30.22,21.33 31.11,22.23 U$1.A1 31.75,20.95 33.02,19.68 34.31,19.68 U5.8 U5.9
N$27
  Top 0.203: C20.1 39.8,10.01 39.8,10.41 40.67,11.27 U5.2 42.65,11.27 R20.1
N$28  (via drill 0.55 pad 0.65)
  Top 0.203: U5.6 U5.7 41.1,18.61 C22.1 40.01,20.9 v40.01,20.95
  Bottom 0.203: v40.01,20.95 37.69,20.95 37.25,20.51 36,20.51 U$1.A0
N$29
  Top 0.203: R22.2 44.56,14.71 R21.1 46.35,14.34 47.16,15.14 47.16,18.2 46.98,18.37 44.23,18.37 C22.2
N$30
  Top 0.203: C21.1 44.88,15.82 R22.1 42.97,15.08 U5.5
N$31
  Bottom 0.203: U9.7 26.36,13.64 26.32,13.68 26.32,13.95 R24.1 24.45,14.66 R23.2
N$32
  Bottom 0.203: U9.8 26.88,12.81 26.88,13.7 26.73,13.85 R24.2 26.73,16.83 R26.2 26.35,16.99 25.54,16.18 24.44,16.18 23.83,15.57 22.77,15.57 22.53,15.34 22.53,15.13 R25.2
N$33
  Bottom 0.203: C25.2 21.11,9.21 20.3,8.4 18.95,8.4 18.77,8.58 18.77,9.69 18.41,10.05 17.12,10.05 16.94,10.23 16.94,11.04 17.12,11.22 17.55,11.22 U8.13 18.92,12.59 19.35,12.59 19.41,12.64 R25.1
N$34
  Bottom 0.203: U9.6 25.58,12.81 25.58,13.7 25.4,13.88 24.72,13.88 24.54,13.7 24.54,12.47 23.76,11.7 23.13,11.7 22.07,10.64 19.68,10.64 | 19.68,10.64 U8.14 | C25.1 19.63,10.58 19.68,10.64
N$35
  Bottom 0.203: C27.1 26.41,18.53 R26.1 24.47,16.59 24.27,16.59 23.66,15.98 R27.2
N$36
  Bottom 0.203: C26.1 22.11,17.68 R27.1 21.11,17.3 20.64,16.83 20.49,16.83 20.31,16.65 20.31,16.51 19.52,15.72 U8.10
N$37
  Bottom 0.203: 6.99,12.18 6.82,12 6.82,11.36 5.25,9.8 5.25,9.38 5.07,9.2 4.66,9.2 4.45,8.99 R28.2 | U10.7 10.36,10.27 10.36,11.16 9.33,12.18 6.99,12.18 | R29.1 5.38,12.18 6.99,12.18
N$38
  Bottom 0.203: U10.8 11.01,10.27 11.01,11.16 9.57,12.59 9.42,12.59 R30.2 R31.2 4.97,14.82 R29.2
N$39
  Bottom 0.203: C29.2 11.19,12.72 11.19,12.36 12.92,10.64 13.34,10.64 | 13.34,10.64 U8.1 | U10.6 9.96,10.01 9.96,9.13 10.14,8.95 11.65,8.95 13.34,10.64
N$40
  Bottom 0.203: U8.9 U8.8 20.32,20.34 23.72,20.34 | U$1.A4 24.71,21.65 23.98,20.92 23.96,20.92 23.72,20.68 23.72,20.34 | C27.2 24.71,19.36 23.72,20.34
N$41
  Bottom 0.203: U8.2 13.35,12.06 12.06,12.06 11.6,12.53 11.6,14.02 C29.1 10.64,14.98 R30.1
N$42
  Bottom 0.203: U8.6 U8.7 14.01,18.75 14.01,20.31 | 14.01,20.31 14.21,20.51 19.47,20.51 19.91,20.95 20.95,20.95 21.59,21.59 U$1.A5 | C31.1 7.72,19.68 13.38,19.68 14.01,20.31
N$43
  Bottom 0.203: R31.1 6.51,15.88 C31.2 7.21,16.07 9.36,16.07 9.74,16.45 R32.2
N$44
  Bottom 0.203: U8.5 13.35,15.88 12.06,15.88 11.6,16.34 11.6,17.13 10.79,17.93 R32.1 10.43,18.15 C30.1
N$45
  Bottom 0.203: R33.2 R34.1 48.26,13.97 49.06,13.16 49.06,9.86 48.31,9.11 47.62,9.11 47.44,9.28 47.44,10.17 U12.7
N$46
  Bottom 0.203: R35.2 R36.2 R34.2 47.97,12.19 U12.8
N$47
  Bottom 0.203: C34.2 40.01,6.35 39.2,7.16 39.2,8.51 39.38,8.69 39.8,8.69 40.44,9.32 40.44,10.41 40.62,10.59 41.7,10.59 41.73,10.62 U11.13 41.73,11.47 42.22,11.96 42.85,11.96 43.03,12.14 43.03,12.76 R35.1
N$48
  Bottom 0.203: C34.1 41.73,9.56 U11.14 44.18,10 45.67,11.49 46.36,11.49 46.54,11.31 46.54,10.43 U12.6
N$49
  Bottom 0.203: R37.2 45.88,16.3 C36.1 R36.1
N$50
  Bottom 0.203: C35.1 44.45,20.06 R37.1 44.45,17.78 43.65,16.97 43.65,15.07 43.18,14.61 42.21,14.61 U11.10
N$51
  Bottom 0.203: U13.7 33.37,12.81 33.37,13.7 33.2,13.88 31.86,13.88 31.68,13.7 31.68,13.05 R39.1 28.89,13.44 R38.2
N$52
  Bottom 0.203: R39.2 30.48,15.34 R41.2 30.72,15.21 32.36,15.21 | R40.2 32.36,15.21 | 32.36,15.21 33.29,14.28 33.44,14.28 34.15,13.57 U13.8
N$53
  Bottom 0.203: C38.2 36.83,6.35 36.02,7.16 36.02,9.02 37,9.99 | 37,9.99 U11.1 | U13.6 32.98,12.55 32.98,11.67 34.39,10.26 34.66,9.99 37,9.99
N$54
  Bottom 0.203: U11.9 U11.8 42.58,18.47 42.58,18.75 41.79,19.54 41.79,20.32 38.17,23.94 38.1,23.94 | 38.1,23.94 32.38,23.94 31.33,23.94 29.62,22.23 U$1.A2 | C36.2 46.35,21.59 43.59,24.36 38.52,24.36 38.1,23.94
N$55
  Bottom 0.203: R40.1 34.67,14.59 34.67,12.06 35.47,11.27 U11.2 37.69,10.59 38.12,10.59 38.3,10.41 38.3,9.6 38.12,9.42 37.47,9.42 36.83,8.78 C38.1
N$57
  Bottom 0.203: C40.2 R41.1 29.78,16.34 31.21,16.34 31.39,16.52 31.39,18.8 31.92,19.33 33.17,19.33 33.71,18.79 R42.2
N$58
  Bottom 0.203: U11.5 36.58,15.08 35.71,15.95 35.71,16.14 R42.1 34.71,17.14 33.66,17.14 32.54,18.26 C39.1
N$59
  Top 0.203: 9.98,4.81 U1.3 9.85,3.48 10.79,2.54 14.61,2.54 J1.7
N$60
  Top 0.203: 9.33,4.81 U1.2 9.2,3.56 10.63,2.13 11.12,2.13 11.35,1.91 J1.8
N$61
  Top 0.203: U3.2 21.9,6.67 J1.1
N$62
  Bottom 0.203: U9.2 26.36,6.67 25.38,5.69 25.38,3.93 24.65,3.2 22.89,3.2 J1.4
N$63
  Top 0.203: U7.3 45.28,4.81 45.28,3.92 44.7,3.34 43.6,3.34 43.16,3.79 40.5,3.79 40.33,3.96 36.34,3.96 J2.2
N$64
  Top 0.203: U7.2 44.63,4.81 44.63,3.92 44.45,3.75 43.77,3.75 43.07,4.45 J2.1
N$65
  Top 0.203: J2.3 30.91,5.28 30.83,5.28 29.52,6.59 U6.2
N$66
  Top 0.203: U6.3 30.3,7.35 30.3,6.46 31.07,5.69 32.27,5.69 32.99,4.96 32.99,3.93 31.75,2.69 J2.4
N$67
  Top 0.203: U3.3 22.68,7.83 22.68,6.94 22.86,6.76 23.57,6.76 25.38,4.96 25.38,3.93 24.13,2.69 J1.2
N$68
  Bottom 0.203: J1.3 21.59,4.47 23.48,6.36 24.77,6.36 25.58,7.17 25.58,8.46 U9.3
N$69
  Bottom 0.203: U13.2 33.5,6.2 32.99,5.69 28.69,5.69 27.96,4.96 27.96,3.2 J2.8
N$70
  Bottom 0.203: U13.3 32.85,6.18 32.77,6.1 28.32,6.1 J2.7
N$71
  Bottom 0.203: U12.3 46.54,6.08 46.54,5.2 43.02,1.68 36.33,1.68 34.81,3.2 30.45,3.2 J2.5
N$72
  Bottom 0.203: U12.2 47.19,6.08 47.19,5.2 43.26,1.27 35.56,1.27 34.95,0.66 31.23,0.66 29.99,1.91 J2.6
N$73
  Bottom 0.203: U10.2 10.61,5.92 10.61,5.04 10.79,4.86 15.16,4.86 15.99,5.69 17.03,5.69 18.27,4.45 J1.5
N$74
  Bottom 0.203: J1.6 18.27,1.91 16.98,3.2 15.99,3.2 14.75,4.45 10.56,4.45 9.96,5.04 9.96,5.92 U10.3
N$75
  Bottom 0.203: U11.6 U11.7 35.57,19.06 35.57,19.46 35.3,19.73 31.75,19.73 30.98,18.97 30.98,17.59 C40.1 26.67,21.01 U$1.A3
VCC  (via drill 0.55 pad 0.65)
  Top 0.203: C6.+ 3.81,22.23 | 3.81,22.23 4.55,22.23 6.26,23.94 7.62,23.94 | 7.62,23.94 9.31,23.94 10.17,23.07 C5.1 13.12,23.07 U$1.5V 14.38,22.23 16.09,23.94 | 30.82,11.43 30.82,9.43 30.06,8.67 29.18,8.67 29,8.5 29,7.61 U6.1 26.86,7.48 25.86,8.47 25.86,9.75 C10.1 24.39,10.85 U3.5 23.2,10.12 22.23,9.15 21.56,9.15 21.38,8.97 21.38,8.09 U3.1 20.93,7.64 20.9,7.61 20.28,6.99 19.22,6.99 19.05,6.99 15.24,6.99 14.98,7.25 14.98,8.11 14.39,8.7 13.55,8.7 13.32,8.47 C4.1 11.06,8.47 U1.5 10.37,8.9 10.37,7.72 8.47,5.82 8.47,4.86 | 30.82,11.43 U6.5 | 30.82,11.43 31.33,11.43 C15.1 34.12,10.38 35.46,9.04 | U2.4 17.44,13.97 15.88,13.97 15.24,14.61 15.24,17.09 15.9,17.75 | 15.9,17.75 C3.1 17.36,20.94 17.52,21.1 17.52,23.57 17.14,23.94 16.09,23.94 | U7.1 44.24,5.07 | 44.24,5.07 44.24,5.96 44.42,6.13 45.3,6.13 46.06,6.89 U7.5 46.43,9.03 C19.1 48.05,7.83 v48.9,6.99 | U5.4 39.53,13.81 38.73,14.61 v38.73,16.51 38.73,18.36 C14.1 39.37,19.21 38.56,20.01 37.21,20.01 36.88,19.68 34.88,19.68 34.48,20.09 33.19,20.09 32.76,20.52 32.76,23.35 31.34,24.77 16.92,24.77 16.09,23.94 | 3.81,22.23 3.81,18.21 2.69,17.08 2.69,16.19 2.21,15.71 2.21,11.17 2.4,10.99 2.4,4.8 3.82,3.38 7.02,3.38 7.76,4.12 7.76,4.16 7.84,4.23 | U1.1 8.47,4.86 | 8.47,4.86 7.84,4.23 | R1.2 2.22,20.64 3.81,22.23 | 44.24,5.07 44.04,5.27 39.23,5.27 35.46,9.04 | 7.62,23.94 7.49,23.8 7.49,20.88 v7.62,20.91 | v15.24,18.03 15.52,17.75 15.9,17.75 | v35.24,9.04 35.46,9.04 | 7.84,4.23 7.62,4.45 v6.35,4.45
  Bottom 0.203: C33.1 44.66,8.95 U12.5 46.14,10.17 46.14,9.28 46.73,8.7 47.62,8.7 47.97,8.35 U12.1 48.12,6.21 v48.9,6.99 | 32.2,11.3 32.2,10.54 32.96,9.79 33.85,9.79 34.02,9.61 | 32.2,11.3 U13.5 | U13.1 34.02,8.72 34.02,9.61 | 32.2,11.3 C37.1 29.49,8.59 U9.1 27.01,9.82 25.53,11.3 24.26,11.3 | C24.1 24.26,11.3 | 24.26,11.3 25.06,12.1 U9.5 | U10.1 11.01,6.18 11.01,7.07 10.83,7.25 10.16,7.25 9.19,8.22 U10.5 8.81,10.14 C28.1 5.66,9.36 5.66,9.21 5.34,8.9 5.34,5.86 6.35,4.85 v6.35,4.45 | 6.53,20.3 U4.5 7.2,20 v7.62,20.91 7.5,20.87 7.5,22.31 6.88,22.93 C1.1 | C23.1 16.19,18.36 16.19,17.14 | U8.4 15.72,14.45 16.19,14.92 16.19,17.14 | 16.19,17.14 15.31,18.03 v15.24,18.03 | 34.02,9.61 34.59,9.04 v35.24,9.04 | C32.1 37.88,18.45 38.3,18.03 38.3,16.51 v38.73,16.51 38.73,14.61 37.94,13.81 U11.4
VCC/2  (via drill 0.55 pad 0.65)
  Top 0.203: U5.12 40.01,12.54 | 40.01,12.54 U5.3 | R13.1 27.3,11.7 27.48,11.53 27.48,9.96 R8.1 27.11,9.6 v28.57,9.6 | v19.91,11.86 19.91,12.7 | 19.91,12.7 19.91,13.63 v19.94,13.76 | 19.91,12.7 19.75,12.54 U2.3 U2.12 9.95,12.54 8.88,13.61 7.63,13.61 7.18,13.16 6.02,13.16 v4.45,11.59 | R3.1 3.17,5.5 v3.17,8.26 | v48.9,19.68 48.9,17.2 R18.1 48.26,16.35 49.67,14.93 49.67,5.86 45.09,1.27 40.64,1.27 40.01,1.91 v40.01,3.17 | v39.37,12.06 39.53,12.06 40.01,12.54 | v25.94,20.29 26.16,20.51 27.09,20.51 27.68,21.1 27.68,23.36 v28.31,23.98
  Bottom 0.203: U11.3 U11.12 41.05,11.86 40.62,11.86 40.01,11.24 | U8.12 15.88,13.18 | 15.88,13.18 U8.3 | 40.01,11.24 40.01,9.53 39.58,9.1 39.21,9.1 38.79,8.68 38.79,5.87 40.01,4.65 v40.01,3.17 | R23.1 22.55,12.18 22.55,11.97 22.38,11.79 21.12,11.79 21.05,11.86 v19.91,11.86 | v19.94,13.76 16.45,13.76 15.88,13.18 | v28.57,9.6 28.89,9.91 R38.1 27.58,13.16 27.58,18.88 27.09,19.38 26.86,19.38 v25.94,20.29 | R28.1 3.17,8.79 v3.17,8.26 | R28.1 3.28,10.06 2.54,10.79 2.54,15.13 | v4.45,11.59 R28.1 | U4.4 4.63,20 U4.1 3.94,19.98 5.7,18.22 5.7,16.5 5.08,15.88 3.28,15.88 2.54,15.13 | R33.1 48.26,19.05 v48.9,19.68 43.81,24.77 29.21,24.77 | 29.21,24.77 4.45,24.77 1.91,22.23 | 2.54,15.13 1.94,15.73 1.58,15.73 1.12,16.19 1.12,21.45 1.91,22.23 | 40.01,11.24 39.37,11.88 v39.37,12.06 | v28.31,23.98 28.43,23.98 29.21,24.77 | 1.91,22.23 1.91,23.5 J3.1

### Text on the board
tPlace: project superLIMBinal | - subliminal1 board
bPlace: Sakib Chowdhury & Claudia Lutfallah | uwin / capstone 2018